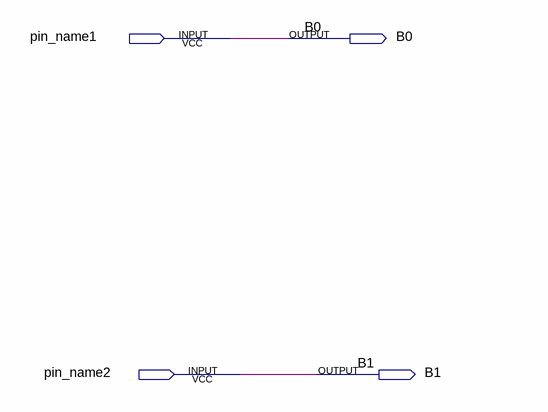
[diagram p0: schematic sheet]
// Quartus schematic frequencycounter.bdf as structural Verilog: 0 symbols, 4 pins
module frequencycounter (
  input  pin_name1,
  input  pin_name2,
  output B0,
  output B1
);


  assign B0 = pin_name1;
  assign B1 = pin_name2;
endmodule
